# Altium schematic sheet RTC_unit.SchDoc
size A4; SheetNumber: 4; SheetTotal: 4
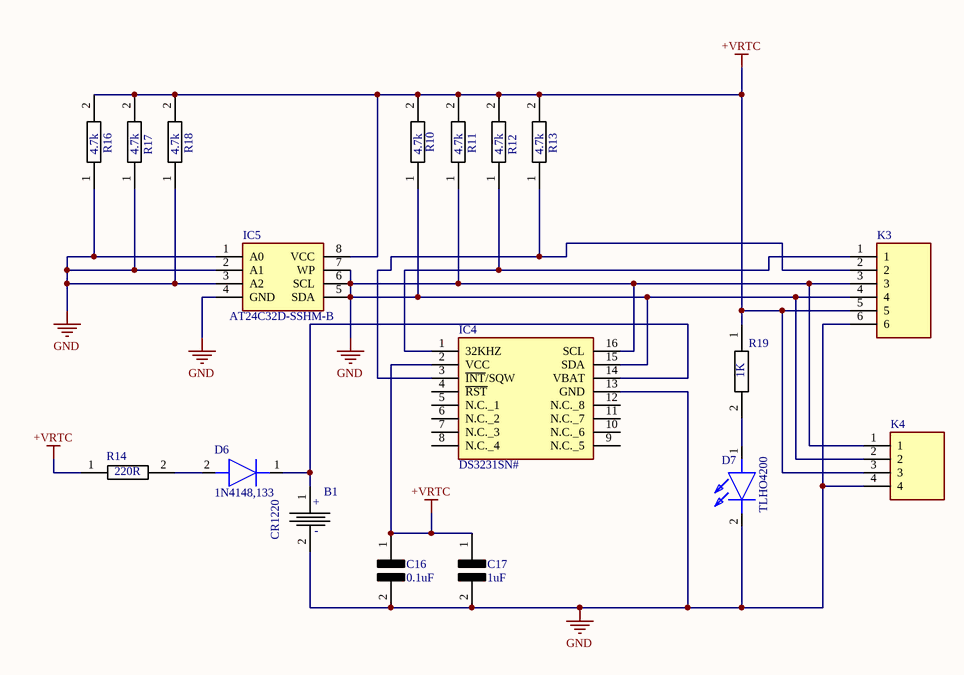
[diagram p0: RTC_unit.SchDoc]

## Parts
B1  CR1220  [CR1220HSMD]
C16  0.1uF  [C0805]
C17  1uF  [C0805]
D6  1N4148,133  [DIOAD1165W56L425D185]
D7  TLHO4200  [TLHO4200]
IC4  DS3231SN#  [SOIC127P1032X265-16N]
IC5  AT24C32D-SSHM-B  [SOIC127P600X175-8N]
K3  2212S-06SG-85  [RHDR6W74P0X254_1X6_1574X250X850P]  (value not drawn)
K4  2212S-04SG-85  [2212S04SG85]  (value not drawn)
R10  4.7k  [C0805]
R11  4.7k  [C0805]
R12  4.7k  [C0805]
R13  4.7k  [C0805]
R14  220R  [C0805]
R16  4.7k  [C0805]
R17  4.7k  [C0805]
R18  4.7k  [C0805]
R19  1K  [C0805]

## Nets
+VRTC: C16.1 C17.1 IC4.2(VCC) IC5.8(VCC) K3.5 K4.3 R10.2 R11.2 R12.2 R13.2 R14.1 R16.2 R17.2 R18.2 R19.1
GND: B1.2 C16.2 C17.2 D7.2(K) IC4.13(GND) IC4.15(SDA) IC4.16(SCL) IC5.1(A0) IC5.2(A1) IC5.3(A2) IC5.4(GND) IC5.5(SDA) IC5.6(SCL) IC5.7(WP) K3.3 K3.4 K3.6 K4.1 K4.2 K4.4 R10.1 R11.1 R16.1 R17.1 R18.1
NetB1_1: B1.1 D6.1(K) IC4.14(VBAT)
NetD6_2: D6.2(A) R14.2
NetD7_1: D7.1(A) R19.2
NetIC4_1: IC4.1(32KHZ) K3.1 R12.1
NetIC4_3: IC4.3(~{INT}/SQW) K3.2 R13.1

Not connected (* = marked no-connect by the designer): IC4 4(~{RST}) 5(N.C._1) 6(N.C._2) 7(N.C._3) 8(N.C._4) 9(N.C._5) 10(N.C._6) 11(N.C._7) 12(N.C._8)

## Notes on the sheet
- (in symbol CR1220-H-SMD) +; -

## Library data of the parts
B1 = CR1220-H-SMD: Integrated Circuit; Manufacturer_Name: ROBOTIS; Datasheet Link: https://www.robotics.org.za/CR1220-H-SMD; Height: 4.1mm; Manufacturer_Part_Number: CR1220-H-SMD
C16 C17 = KeramischeC0805_1: 0805 ceramic capacitor; Manufacturer_Name: Murata Electronics; Manufacturer_Part_Number: GRM188R71H103KA01D; Datasheet Link: https://datasheet.datasheetarchive.com/originals/distributors/Datasheets_SAMA/ec4f1577dddcc7a13ddad897a28002d3.pdf; Height: 0.9mm; Mouser Part Number: 81-GRM39X103K50D; Mouser Price/Stock: https://www.mouser.co.uk/ProductDetail/Murata-Electronics/GRM188R71H103KA01D?qs=WWniysbtxULrL2ljbViAbw%3D%3D; Arrow Part Number: GRM188R71H103KA01D; Arrow Price/Stock: https://www.arrow.com/en/products/grm188r71h103ka01d/murata-manufacturing?region=europe
D6 = 1N4148,133: Diode; Manufacturer_Name: Nexperia; Datasheet Link: https://assets.nexperia.com/documents/data-sheet/1N4148_1N4448.pdf; Manufacturer_Part_Number: 1N4148,133; Mouser Part Number: 771-1N4148,133; Mouser Price/Stock: https://www.mouser.co.uk/ProductDetail/Nexperia/1N4148133?qs=elmhQ6eFu7hy8ApvpFxPZg%3D%3D; Arrow Part Number: 1N4148,133; Arrow Price/Stock: https://www.arrow.com/en/products/1n4148133/nxp-semiconductors
D7 = TLHO4200: LED; Manufacturer_Name: Vishay; Datasheet Link: https://www.mouser.com/datasheet/2/427/tlhg420-1767350.pdf; Height: 6.1mm; Manufacturer_Part_Number: TLHO4200
IC4 = DS3231SN#: Integrated Circuit; Manufacturer_Name: Analog Devices; Datasheet Link: https://datasheets.maximintegrated.com/en/ds/DS3231.pdf; Height: 2.65mm; Manufacturer_Part_Number: DS3231SN#; Mouser Part Number: 700-DS3231SN#; Mouser Price/Stock: https://www.mouser.co.uk/ProductDetail/Analog-Devices-Maxim-Integrated/DS3231SN?qs=1eQvB6Dk1vhUlr8%2FOrV0Fw%3D%3D; Arrow Part Number: DS3231SN#; Arrow Price/Stock: https://www.arrow.com/en/products/ds3231sn/analog-devices?region=europe
IC5 = AT24C32D-SSHM-B: Integrated Circuit; Manufacturer_Name: Microchip; Datasheet Link: http://www.atmel.com/images/atmel-8866-seeprom-at24c32d-datasheet.pdf; Height: 1.75mm; Manufacturer_Part_Number: AT24C32D-SSHM-B; Mouser Part Number: 556-AT24C32D-SSHM-B; Mouser Price/Stock: https://www.mouser.co.uk/ProductDetail/Microchip-Technology/AT24C32D-SSHM-B?qs=ZZMt4ii29sN2mTRLl%2FnVJA%3D%3D; Arrow Part Number: AT24C32D-SSHM-B; Arrow Price/Stock: https://www.arrow.com/en/products/at24c32d-sshm-b/microchip-technology?region=europe
K3 = 2212S-06SG-85: Connector; Manufacturer_Name: Multicomp Pro; Datasheet Link: http://www.farnell.com/datasheets/2290158.pdf?_ga=2.3406896.1671530057.1506933545-2008293027.1497013038; Height: 8.5mm; Manufacturer_Part_Number: 2212S-06SG-85
K4 = 2212S-04SG-85: Connector; Manufacturer_Name: Multicomp Pro; Datasheet Link: https://componentsearchengine.com/Datasheets/5/2212S-04SG-85.pdf; Height: 8.7mm; Manufacturer_Part_Number: 2212S-04SG-85
R10-R14 R16-R19 = Resistor0805: Manufacturer_Name: Vishay; Manufacturer_Part_Number: CRCW08050000Z0EAHP; Datasheet Link: https://componentsearchengine.com/Datasheets/1/CRCW08051R00FKEAHP.pdf; Height: 0.6mm; Mouser Part Number: 71-CRCW08050000Z0EAH; Mouser Price/Stock: https://www.mouser.co.uk/ProductDetail/Vishay-Dale/CRCW08050000Z0EAHP?qs=pTGEtN%252BMLlDLrJUqQmN2jA%3D%3D; Arrow Part Number: CRCW08050000Z0EAHP; Arrow Price/Stock: https://www.arrow.com/en/products/crcw08050000z0eahp/vishay?region=nac